# EAGLE design H15R80 (EAGLE 9.6.2)

## Sheet 1 of 2
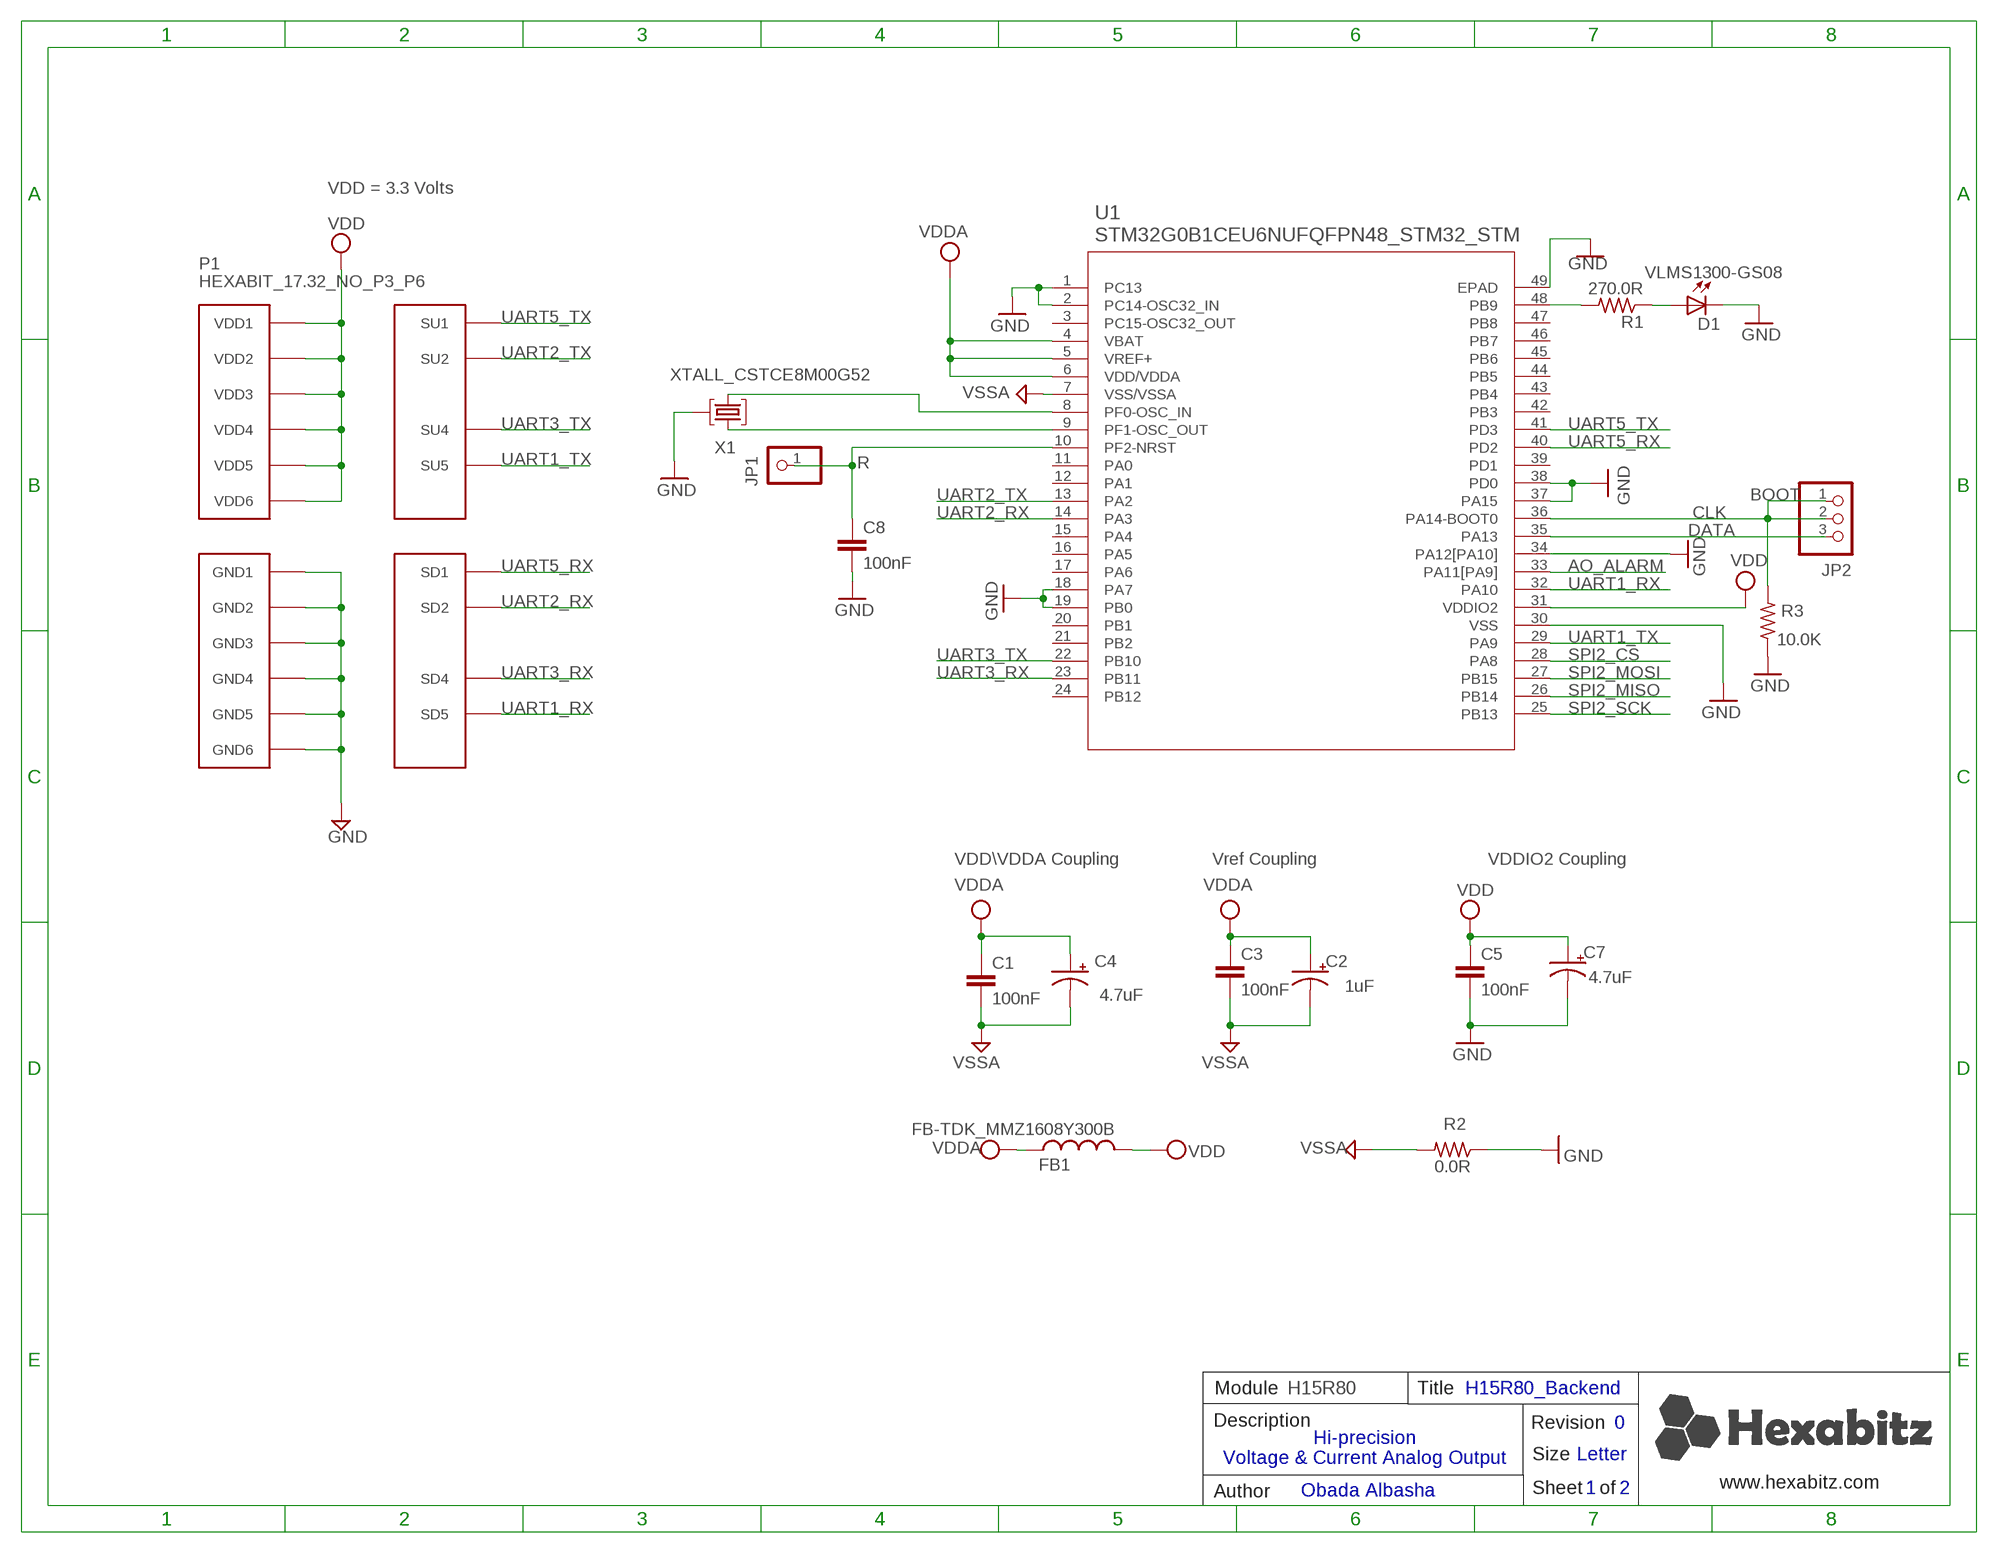
[diagram p0: schematic, sheet 1]

### Parts
C1  100nF  C-0603  [C-0603]
C2  1uF  C-0805-POL  [C-0805-POL]
C3  100nF  C-0603  [C-0603]
C4  4.7uF  C-0805-POL  [C-0805-POL]
C5  100nF  C-0603  [C-0603]
C7  4.7uF  C-0805-POL  [C-0805-POL]
C8  100nF  C-0603  [C-0603]
D1  VLMS1300-GS08  [VLMS1300-GS08]
FB1  FB-TDK_MMZ1608Y300B  [FB-TDK_MMZ1608Y300B]
JP1  R  PINHD-1X1  [1X01]
JP2  PINHD-1X3  [1X03]
P1  HEXABIT_17.32_NO_P3_P6  [HEXABIT_17.32_NO_P3_P6]
R1  270.0R  R-0603  [R-0603]
R2  0.0R  R-0603  [R-0603]
R3  10.0K  R-0603  [R-0603]
U1  STM32G0B1CEU6NUFQFPN48_STM32_STM  [UFQFPN48_STM32_STM]
X1  XTALL_CSTCE8M00G52  [XTALL_CSTCE8M00G52]

### Nets
AO_ALARM: U1.33(PA11[PA9]) ; also sheet 2
CLK: JP2.1 JP2.2 R3.2 U1.36(PA14-BOOT0)
DATA: JP2.3 U1.35(PA13)
GND: C5.2 C7.2(-) C8.2 D1.C P1.PAD_PD7(GND1) P1.PAD_PD8(GND2) P1.PAD_PD9(GND3) P1.PAD_PD10(GND4) P1.PAD_PD11(GND5) P1.PAD_PD12(GND6) R2.1 R3.1 U1.1(PC13) U1.2(PC14-OSC32_IN) U1.18(PA7) U1.19(PB0) U1.30(VSS) U1.34(PA12[PA10]) U1.37(PA15) U1.38(PD0) U1.49(EPAD) X1.P$2
N$3: R1.2 U1.48(PB9)
N$4: D1.A R1.1
N$5: C8.1 JP1.1 U1.10(PF2-NRST)
N$6: U1.9(PF1-OSC_OUT) X1.P$1
N$7: U1.8(PF0-OSC_IN) X1.P$3
SPI2_CS: U1.28(PA8) ; also sheet 2
SPI2_MISO: U1.26(PB14) ; also sheet 2
SPI2_MOSI: U1.27(PB15) ; also sheet 2
SPI2_SCK: U1.25(PB13) ; also sheet 2
UART1_RX: P1.PAD_PD5(SD5) U1.32(PA10)
UART1_TX: P1.PAD_PU5(SU5) U1.29(PA9)
UART2_RX: P1.PAD_PD2(SD2) U1.14(PA3)
UART2_TX: P1.PAD_PU2(SU2) U1.13(PA2)
UART3_RX: P1.PAD_PD4(SD4) U1.23(PB11)
UART3_TX: P1.PAD_PU4(SU4) U1.22(PB10)
UART5_RX: P1.PAD_PD1(SD1) U1.40(PD2)
UART5_TX: P1.PAD_PU1(SU1) U1.41(PD3)
VDD: C5.1 C7.1(+) FB1.2 P1.PAD_PU7(VDD1) P1.PAD_PU8(VDD2) P1.PAD_PU9(VDD3) P1.PAD_PU10(VDD4) P1.PAD_PU11(VDD5) P1.PAD_PU12(VDD6) U1.31(VDDIO2)
VDDA: C1.1 C2.1(+) C3.1 C4.1(+) FB1.1 U1.4(VBAT) U1.5(VREF+) U1.6(VDD/VDDA) ; also sheet 2
VSSA: C1.2 C2.2(-) C3.2 C4.2(-) R2.2 U1.7(VSS/VSSA) ; also sheet 2
Unconnected: U1.3(PC15-OSC32_OUT) U1.11(PA0) U1.12(PA1) U1.15(PA4) U1.16(PA5) U1.17(PA6) U1.20(PB1) U1.21(PB2) U1.24(PB12) U1.39(PD1) U1.42(PB3) U1.43(PB4) U1.44(PB5) U1.45(PB6) U1.46(PB7) U1.47(PB8)

### Notes on the sheet
- VDD = 3.3 Volts
- BOOT
- VDD\VDDA Coupling | Vref Coupling | VDDIO2 Coupling
- Module | H15R80 | Title | H15R80_Backend
- Description | Revision | 0
- Hi-precision
  Voltage & Current Analog Output
- Size | Letter
- www.hexabitz.com
- Author | Obada Albasha | Sheet   of | 1 | 2
- C:/Users/Admin/Desktop/logodraft.bmp

## Sheet 2 of 2
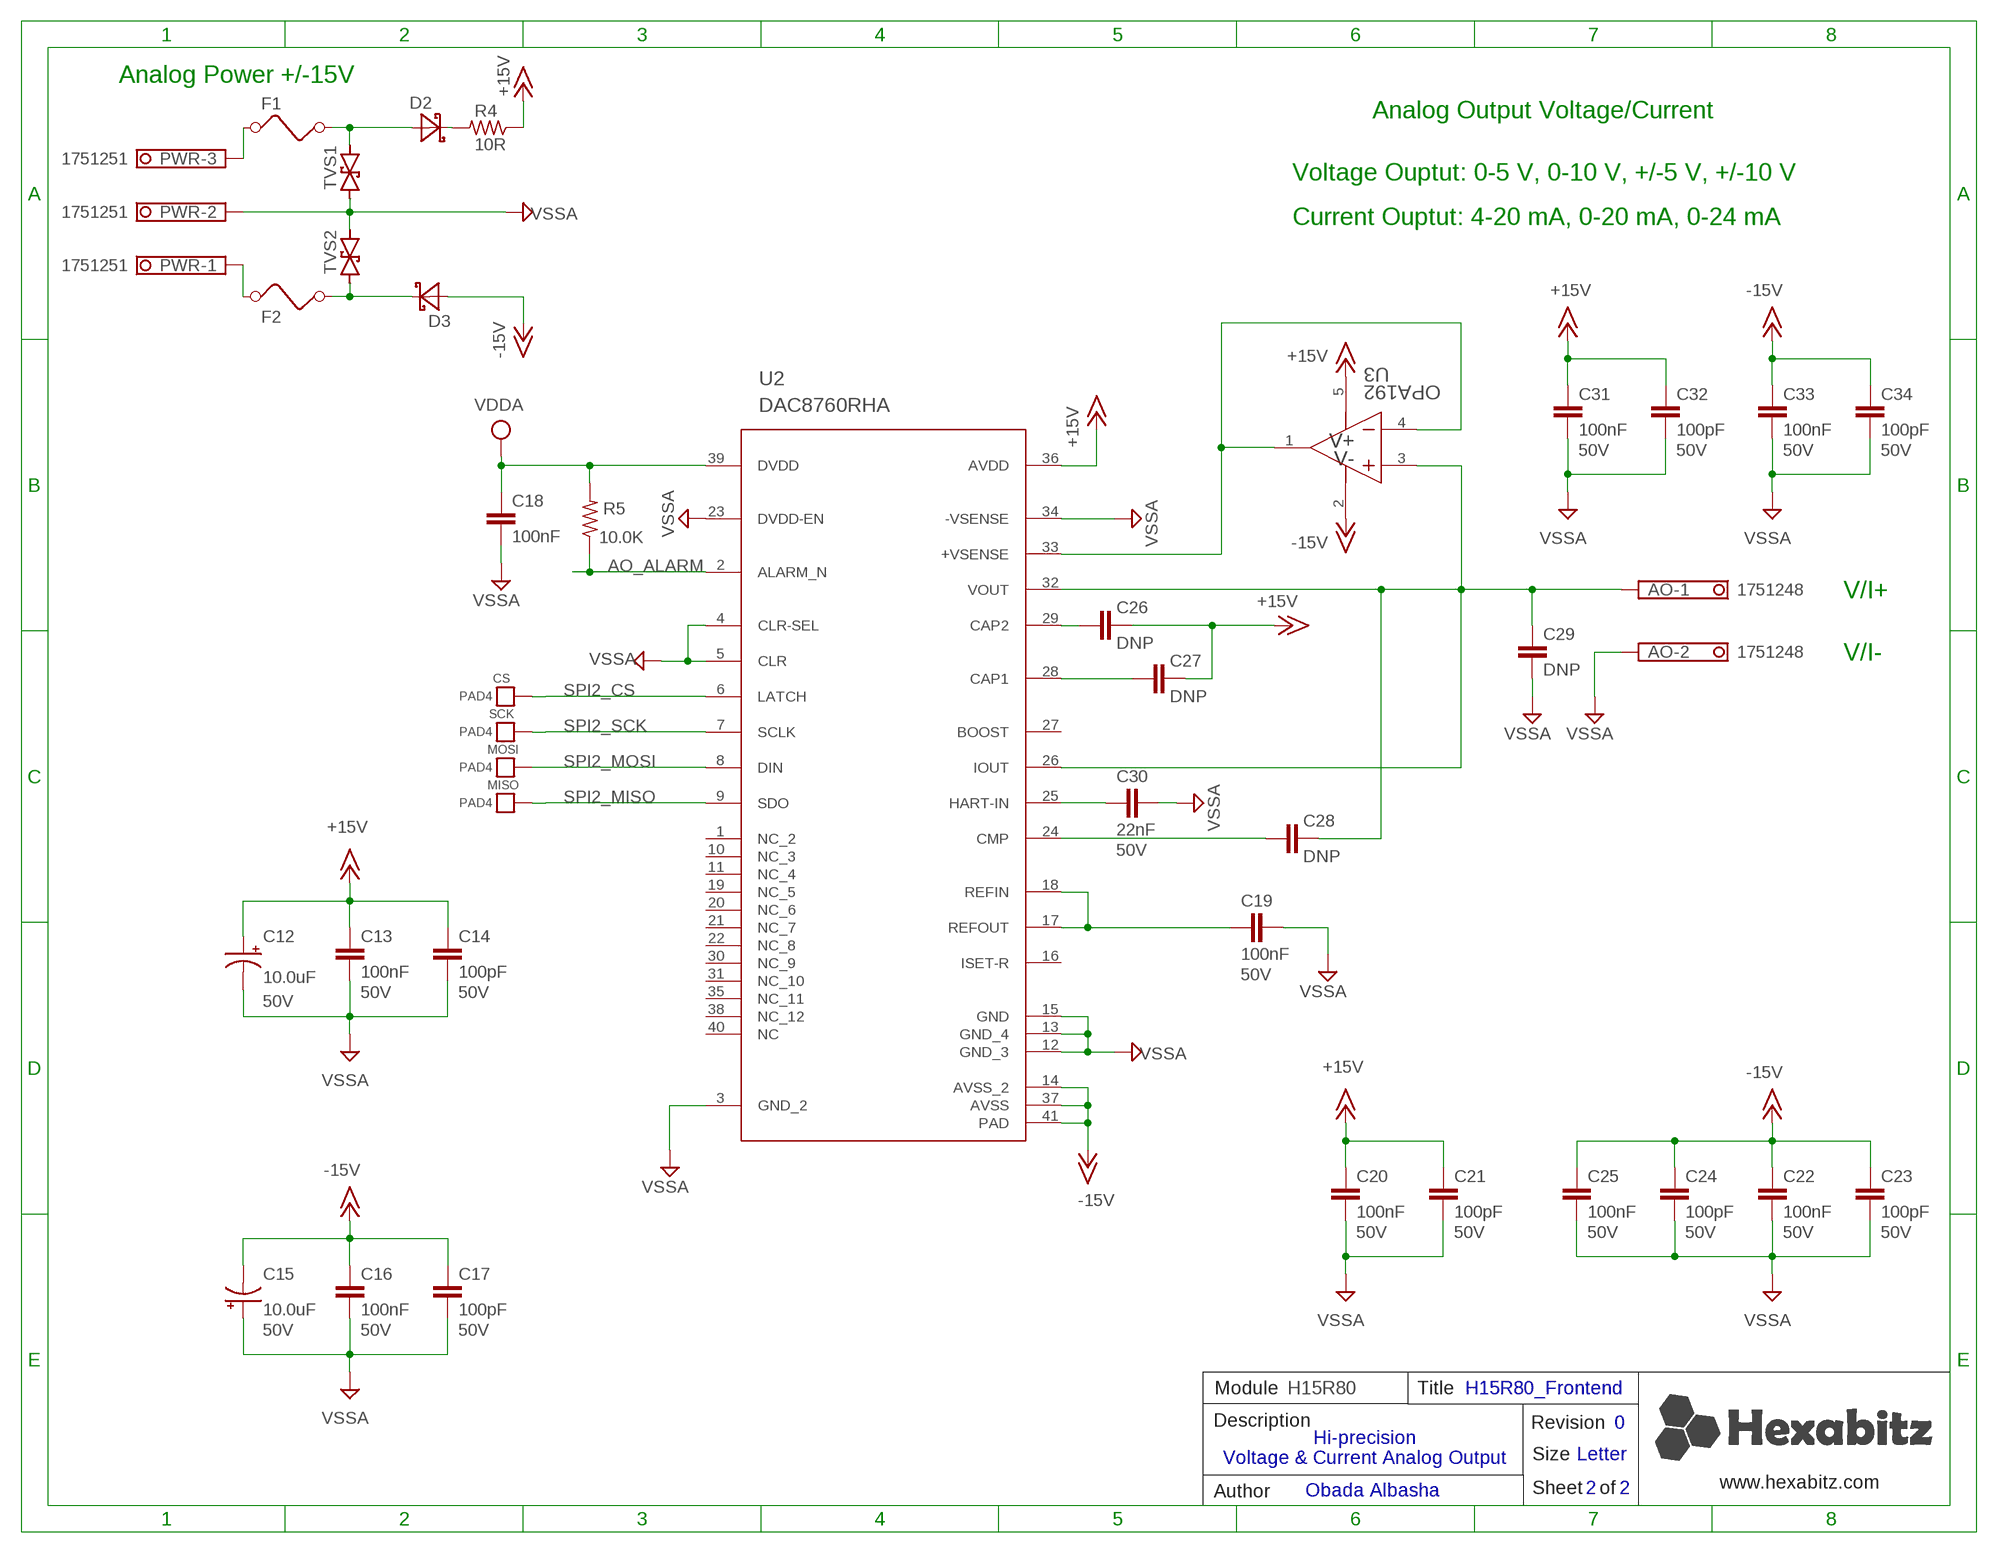
[diagram p1: schematic, sheet 2]

### Parts
AO  1751248  [1751248]
C12  10.0uF  CPOL-USCT7343  [CT7343]
C13  100nF  C-0603  [C-0603]
C14  100pF  C-0603  [C-0603]
C15  10.0uF  CPOL-USCT7343  [CT7343]
C16  100nF  C-0603  [C-0603]
C17  100pF  C-0603  [C-0603]
C18  100nF  C-0603  [C-0603]
C19  100nF  C-0603  [C-0603]
C20  100nF  C-0603  [C-0603]
C21  100pF  C-0603  [C-0603]
C22  100nF  C-0603  [C-0603]
C23  100pF  C-0603  [C-0603]
C24  100pF  C-0603  [C-0603]
C25  100nF  C-0603  [C-0603]
C26  DNP  C-0603  [C-0603]
C27  DNP  C-0603  [C-0603]
C28  DNP  C-0603  [C-0603]
C29  DNP  C-0603  [C-0603]
C30  22nF  C-0603  [C-0603]
C31  100nF  C-0603  [C-0603]
C32  100pF  C-0603  [C-0603]
C33  100nF  C-0603  [C-0603]
C34  100pF  C-0603  [C-0603]
CS  PAD4  [PAD4]
D2  DIOD-SOD-123  [SOD123]
D3  DIOD-SOD-123  [SOD123]
F1  NANOSMDC035F-2120  [R1206]
F2  NANOSMDC035F-2120  [R1206]
MISO  PAD4  [PAD4]
MOSI  PAD4  [PAD4]
PWR  1751251  [1751251]
R4  10R  R-0603  [R-0603]
R5  10.0K  R-0603  [R-0603]
SCK  PAD4  [PAD4]
TVS1  SMBJ30CA  [DO214AA]
TVS2  SMBJ30CA  [DO214AA]
U2  DAC8760RHA  DAC7760IRHAR  [RHA0040A]
U3  OPA192  OPA192IDBVR  [DBV0005A_N]

### Nets
+15V: C12.+ C13.1 C14.1 C20.1 C21.1 C26.2 C27.2 C31.1 C32.1 R4.1 U2.36(AVDD) U3.5(V+)
-15V: C15.- C16.1 C17.1 C22.1 C23.1 C24.1 C25.1 C33.1 C34.1 D3.1(A) U2.14(AVSS_2) U2.37(AVSS) U2.41(PAD) U3.2(V-)
AO_ALARM: R5.1 U2.2(ALARM_N) ; also sheet 1
N$1: AO.1 C28.2 C29.2 U2.26(IOUT) U2.32(VOUT) U3.3(IN+)
N$2: C19.1 U2.17(REFOUT) U2.18(REFIN)
N$8: C26.1 U2.29(CAP2)
N$9: F1.1 PWR.3
N$10: C27.1 U2.28(CAP1)
N$11: C28.1 U2.24(CMP)
N$12: F2.1 PWR.1
N$13: U2.33(+VSENSE) U3.1(OUT) U3.4(IN-)
N$14: C30.1 U2.25(HART-IN)
N$15: D3.2(C) F2.2 TVS2.A
N$16: D2.1(A) F1.2 TVS1.C
N$17: D2.2(C) R4.2
SPI2_CS: CS.P$1 U2.6(LATCH) ; also sheet 1
SPI2_MISO: MISO.P$1 U2.9(SDO) ; also sheet 1
SPI2_MOSI: MOSI.P$1 U2.8(DIN) ; also sheet 1
SPI2_SCK: SCK.P$1 U2.7(SCLK) ; also sheet 1
VDDA: C18.1 R5.2 U2.39(DVDD) ; also sheet 1
VSSA: AO.2 C12.- C13.2 C14.2 C15.+ C16.2 C17.2 C18.2 C19.2 C20.2 C21.2 C22.2 C23.2 C24.2 C25.2 C29.1 C30.2 C31.2 C32.2 C33.2 C34.2 PWR.2 TVS1.A TVS2.C U2.3(GND_2) U2.4(CLR-SEL) U2.5(CLR) U2.12(GND_3) U2.13(GND_4) U2.15(GND) U2.23(DVDD-EN) U2.34(-VSENSE) ; also sheet 1
Unconnected: U2.1(NC_2) U2.10(NC_3) U2.11(NC_4) U2.16(ISET-R) U2.19(NC_5) U2.20(NC_6) U2.21(NC_7) U2.22(NC_8) U2.27(BOOST) U2.30(NC_9) U2.31(NC_10) U2.35(NC_11) U2.38(NC_12) U2.40(NC)

### Notes on the sheet
- Analog Power +/-15V
- Analog Output Voltage/Current
- Voltage Ouptut: 0-5 V, 0-10 V, +/-5 V, +/-10 V
- Current Ouptut: 4-20 mA, 0-20 mA, 0-24 mA
- V/I+
- V/I-
- Module | H15R80 | Title | H15R80_Frontend
- Description | Revision | 0
- Hi-precision
  Voltage & Current Analog Output
- Size | Letter
- www.hexabitz.com
- Author | Obada Albasha | Sheet   of | 2 | 2

## Library data of the parts
AO = con-phoenix-350:1751248: MKDS 1/ 2-3,5 Printklemme Nennstrom: 10 A Bemessungsspannung: 160 V Raster: 3,5 mm Polzahl: 2 Montageart: Löten Anschlussart: Schraubanschluss Anschlussrichtung vom Leiter zur Platine: 0° Source: http://eshop.phoenixcontact.com .. 1751248.pdf; MFN: Phoenix Contact; MPN: 1751248; OCTOPART_URL: https://octopart.com/1751248-phoenix+contact-31334?r=sp&s=dfbEyNHiQNetUL69ahOrPQ; OC_FARNELL: unknown; OC_NEWARK: unknown
C1 = Hexabitz:C-0603: CAP CER 10% X7R 0603; CAPACITANCE: 10nF; MFN: KEMET; MPN: C0603C103K5RACTU; OCTOPART_URL: https://octopart.com/c0603c103k5ractu-kemet-133094?r=sp&s=R_iPBxLnSmGqhkU2rIMFpg; TOLERANCE: 10%; VOLTAGE_RATING: 50V
C2 C7 = Hexabitz:C-0805-POL: Cap Tant Solid SMD 2012; CAPACITANCE: 4.7uF; MFN: Murata; MPN: GRM21BC81E475KA12L; OCTOPART_URL: https://octopart.com/grm21bc81e475ka12l-murata-10331911?r=sp&s=RY3qZSD8T6mG6TC9CHI5qQ; TOLERANCE: 10%; VOLTAGE_RATING: 25V
C3 C8 C18 = Hexabitz:C-0603: CAP CER 10% X7R 0603; CAPACITANCE: 100nF; MFN: KEMET; MPN: C0603C104K8RACTU; OCTOPART_URL: https://octopart.com/c0603c104k8ractu-kemet-145075?r=sp&s=9bS9ASSwSEqMCE9KBEQZ0g; TOLERANCE: 10%; VOLTAGE_RATING: 10V
C4 = Hexabitz:C-0805-POL: Cap Tant Solid SMD 2012; CAPACITANCE: 1.00uF; MFN: Yageo; MPN: CC0805KKX7R7BB105; OCTOPART_URL: https://octopart.com/cc0805kkx7r7bb105-yageo-8376555?r=sp&s=YKl1wwtkROau_X5nniH2ig; TOLERANCE: 10%; VOLTAGE_RATING: 16V
C5 = Hexabitz:C-0603: CAP CER 10% X7R 0603; CAPACITANCE: 100nF; MFN: KEMET; MPN: C0603C104K8RACTU; OCTOPART_URL: https://octopart.com/c0603c104k8ractu-kemet-145075?r=sp&s=9bS9ASSwSEqMCE9KBEQZ0g; TOLERANCE: 10%; VOLTAGE_RATING: 10
C12 C15 = rcl:CPOL-US: POLARIZED CAPACITOR, American symbol; CAPACITANCE: 10.0uF; MFN: KEMET; MPN: T491D106K050AT; OCTOPART_URL: https://octopart.com/t491d106k050at-kemet-968220?r=ap&s=K_G_zr40QourN4WdchG6mQ#; SPICEPREFIX: C; VOLTAGE: 50V
C13 C16 C19 C20 C22 C25 C31 C33 = Hexabitz:C-0603: CAP CER 10% X7R 0603; CAPACITANCE: 100nF; MFN: Samsung; MPN: CL10B104KB8NNNC; OCTOPART_URL: https://octopart.com/cl10b104kb8nnnc-samsung-7928277?r=sp&s=fIKkgin8S22eXTUxF1gXsw; TOLERANCE: 10%; VOLTAGE_RATING: 50V
C14 C17 C21 C23 C24 C32 C34 = Hexabitz:C-0603: CAP CER 10% X7R 0603; CAPACITANCE: 100pF; MFN: Avx; MPN: 06035A101JAT2A; OCTOPART_URL: https://octopart.com/06035a101jat2a-avx-55386344?r=sp&s=WDfgRo-ITV2A4U5JT5ZyKQ; TOLERANCE: 10%; VOLTAGE_RATING: 50V
C26-C29 = Hexabitz:C-0603: CAP CER 10% X7R 0603; CAPACITANCE: DNP; MPN: DNP
C30 = Hexabitz:C-0603: CAP CER 10% X7R 0603; CAPACITANCE: 22nF; MFN: TDK; MPN: C1608X7R1H223K080AA; OCTOPART_URL: https://octopart.com/c1608x7r1h223k080aa-tdk-25947667?r=sp&s=T8cT_uRxS7ewuHBmxCxszg; TOLERANCE: 10%; VOLTAGE_RATING: 50V
CS MISO MOSI SCK = HEXABITZ_CONNECTION_PARTS:PAD4
D1 = Hexabitz:VLMS1300-GS08: Red 0603 130° Clear 54 mcd 2 V Surface Mount ChipLED ; Octopart Url : http://octopart.com/vlms1300-gs08-vishay-21709201; MFN: Vishay; MPN: VLMS1300-GS08; OCTOPART_URL: https://octopart.com/vlms1300-gs08-vishay-21709201?r=sp&s=_gcP4_q8T1SC6PJQPTQ9yA
D2 D3 = HEXABITZ_RCLS:DIOD-SOD-123: 1.0 A Surface Mount Schottky Barrier Rectifier, 40 V, -65 to 125 degC, 2-Pin SOD-123 Package, RoHS, Tape and Reel
F1 F2 = HEXABITZ_RCLS:NANOSMDC035F-2: PTC Resettable Fuse 0.35A(hold) 0.75A(trip) 16VDC 20A 0.6W 0.1s 0.45Ohm SMD Solder Pad 1206; MFN: Littelfuse; MPN: NANOSMDC035F-2; OCTOPART_URL: https://octopart.com/nanosmdc035f-2-littelfuse-74215052?r=sp&s=rfNZOPvgSJy5H1V-bbPI5Q#
FB1 = Hexabitz:FB-TDK_MMZ1608Y300B: Ferrite Beads Multi-Layer 30Ohm 25% 100MHz 1.5A 50mOhm DCR 0603; MFN: TDK; MPN: MMZ1608Y300B; OCTOPART_URL: https://octopart.com/mmz1608y300b-tdk-368280?r=sp&s=cd9_2ZEqQ9q9UNBuQgHAiA
JP1 = HEXABITZ_USER_INTERFACE_PARTS:PINHD-1X1: PIN HEADER; MFN: TE Connectivity; MPN: 87227-1; OCTOPART_URL: https://octopart.com/87227-1-te+connectivity-39512052?r=sp
JP2 = pinhead:PINHD-1X3: PIN HEADER
P1 = hexabitz_connectors:HEXABIT_?_NO_P3_P6: Hexabitz Hexagon Module Connector Hexagon side length = 17.32mm. The following ports are removed: P3 P6
PWR = con-phoenix-350:1751251: MKDS 1/ 3-3,5 Printklemme Nennstrom: 10 A Bemessungsspannung: 160 V Raster: 3,5 mm Polzahl: 3 Montageart: Löten Anschlussart: Schraubanschluss Anschlussrichtung vom Leiter zur Platine: 0° Source: http://eshop.phoenixcontact.com .. 1751251.pdf; MFN: Phoenix Contact; MPN: 1751251; OCTOPART_URL: https://octopart.com/1751251-phoenix+contact-36473?r=sp&s=9M0VWNoHTyq04j3qI6lQOQ; OC_FARNELL: unknown; OC_NEWARK: unknown
R1 = Hexabitz:R-0603: Thick Film Resistors - SMD 0603; MFN: Yageo; MPN: RC0603FR-07270RL; OCTOPART_URL: https://octopart.com/search?q=RC0603FR-07270RL&start=0; RESISTANCE: 270.0 Ohm; TOLERANCE: 1%
R2 = Hexabitz:R-0603: Thick Film Resistors - SMD 0603; MFN: Yageo; MPN: RC0603JR-070RL; OCTOPART_URL: https://octopart.com/rc0603jr-070rl-yageo-1241539?r=sp&s=X2NteqRjRNWrnx42Y0aliA; RESISTANCE: 0.0 Ohm
R3-R5 = Hexabitz:R-0603: Thick Film Resistors - SMD 0603; MFN: Yageo; MPN: RC0603JR-0710KL; OCTOPART_URL: https://octopart.com/search?q=RC0603JR-0710KL&start=0; RESISTANCE: 10.0K Ohm; TOLERANCE: 5%
TVS1 TVS2 = HEXABITZ_RCLS:SMBJ30CA: TVS Diode; MFN: ON Semiconductor; MPN: SMBJ30CA; OCTOPART_URL: https://octopart.com/smbj30ca-on+semiconductor-84331460?r=sp&s=Vl5BdVYHQCeKmKgfbE4rMg
U1 = HEXABITZ_ICs:STM32G0B1CEU6N; COPYRIGHT: Copyright (C) 2022 Ultra Librarian. All rights reserved.; MFN: STMicroelectronics; MPN: STM32G0B1CEU6N; OCTOPART_URL: https://app.ultralibrarian.com/details/c038d58b-752a-11eb-9033-0a34d6323d74/STMicroelectronics/STM32G0B1CEU6N?uid=116364672
U2 = Hexabitz:DAC7760IRHAR: 16-Bit Single-Channel Programmable Current/Voltage Output DAC for 4-20mA current loop applications; MANUFACTURER: Texas Instruments; MFN: Texas Instruments; MPN: DAC8760IRHAR; OCTOPART_URL: https://octopart.com/dac8760irhar-texas+instruments-29661993?r=sp&s=ruhaz_LcRdqODQmkWKrlGA; PARTNUMBER: DAC7760IRHAR; REFDES: RefDes; TYPE: TYPE
U3 = Hexabitz:OPA192IDBVR; ALTERNATE_PARTNUMBER: OPA192IDBVT; APPLICATION_BUILDNUMBER: *; COMPTYPE: IC; MANUFACTURER: Texas Instruments; MFN: Texas Instruments; MOUNTTYPE: SMT; MPN: OPA192IDBVR; OCTOPART_URL: https://octopart.com/opa192idbvr-texas+instruments-33513820?r=sp&s=D6KF1OAATrGkqNyouFfzCw; PACKAGEREFERENCE: DBV0005A; PARTNUMBER: OPA192IDBVR; PIN_COUNT: 5; REFDES: RefDes; ROHS: Y; TYPE: TYPE; VALUE: Value
X1 = Hexabitz:XTALL_CSTCE8M00G52: MURATA CSTCE8M00G52-R0 RESONATOR, SMD, 8MHZ ; Octopart Url : https://octopart.com/cstce8m00g52-r0-murata-7145559; MFN: Murata; MPN: CSTCE8M00G52Z-R0; OCTOPART_URL: https://octopart.com/cstce8m00g52z-r0-murata-17755941?r=sp&s=JDnNJnrHQhyS8Zk4ofFWXw

## Board
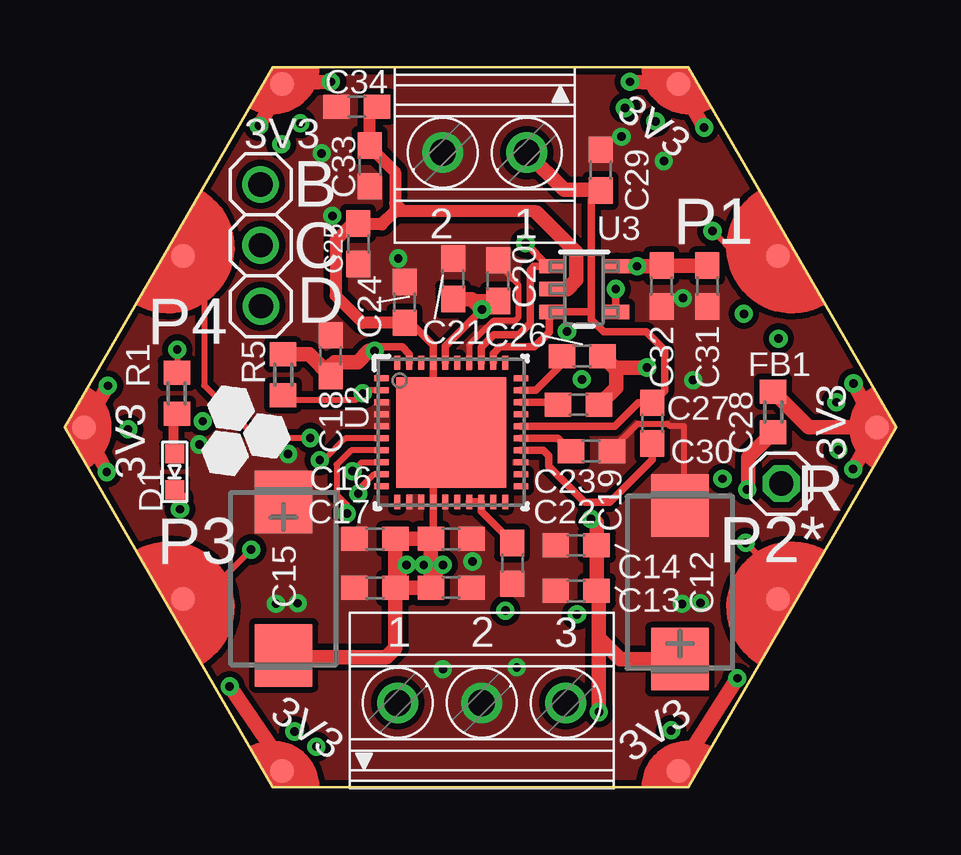
[diagram p2: board, top side]
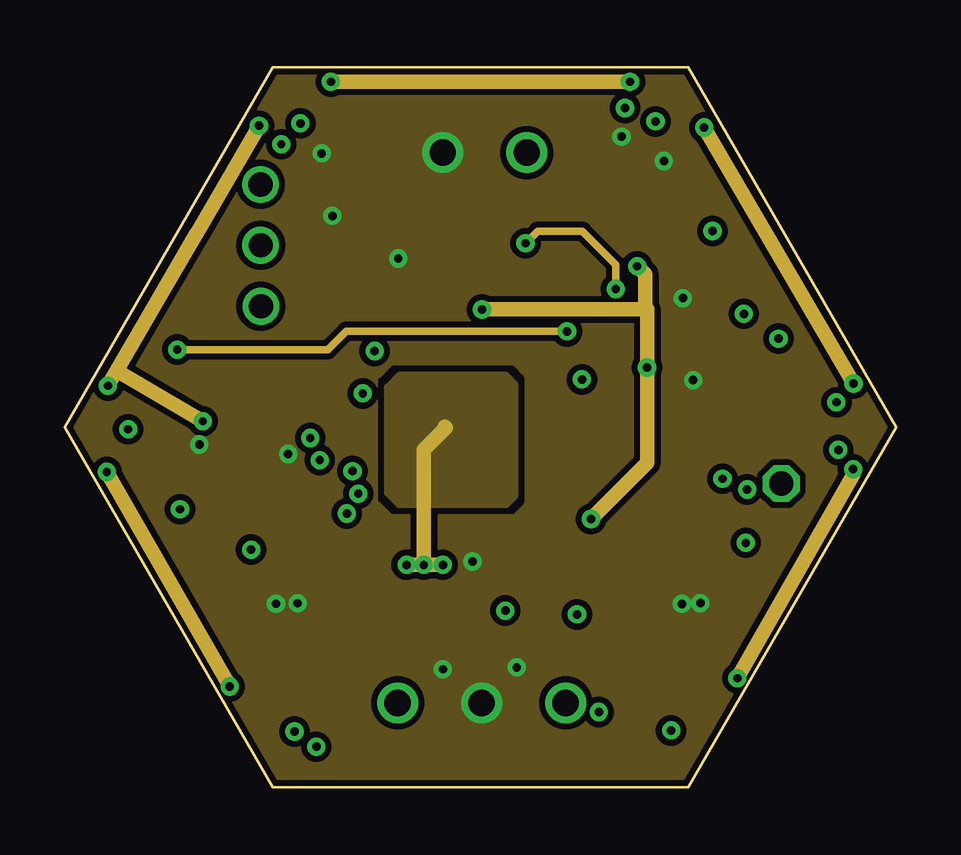
[diagram p3: board, inner layer Route2]
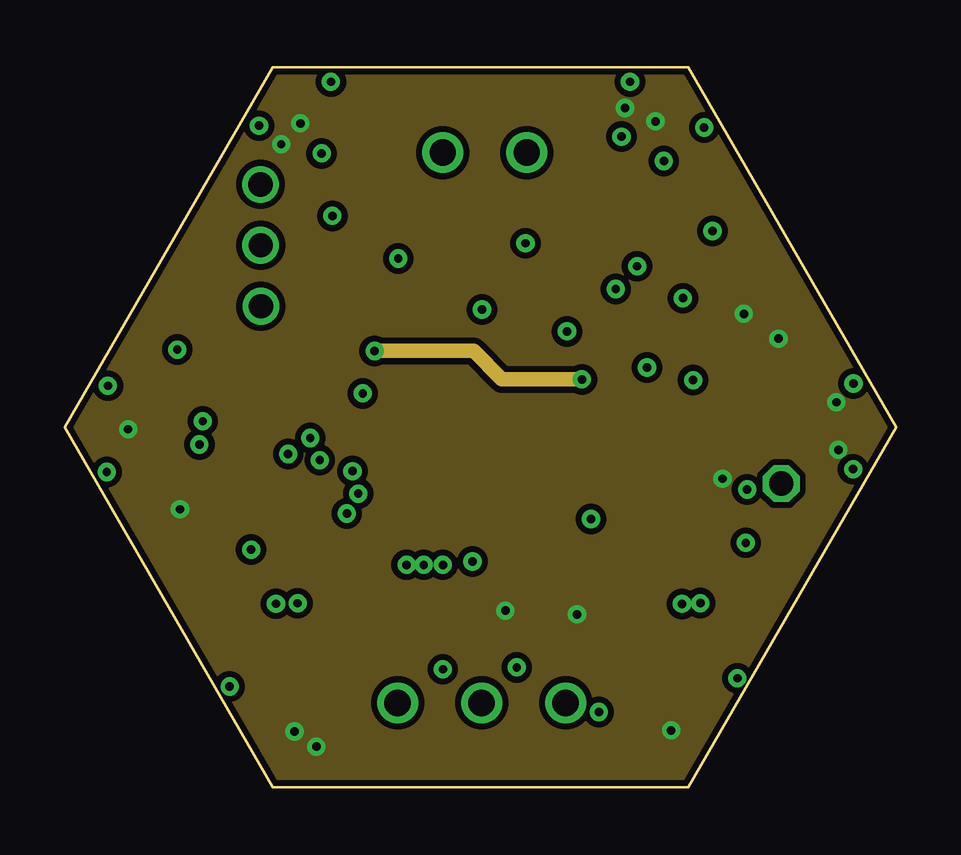
[diagram p4: board, inner layer Route15]
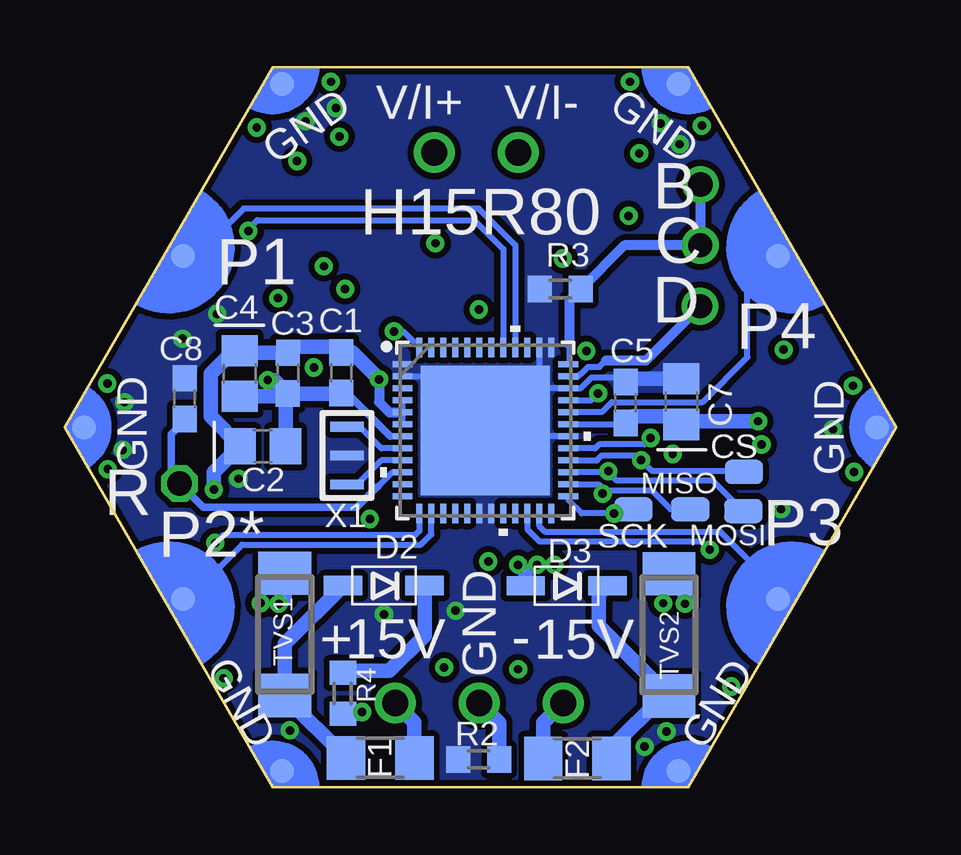
[diagram p5: board, bottom side, seen from below]

Size 34.64 x 30 mm. Coordinates in mm from the lower left corner, seen from the top.
Copper layers ([2:1+2*15+16:15]): Top 0.035mm / dielectric 0.175mm / Route2 0.035mm / dielectric 1.11mm / Route15 0.035mm / dielectric 0.175mm / Bottom 0.035mm
Design rules "2_layer *": minimum track width 7mil, minimum drill 10mil, track to track 6mil, track to pad 6mil, pad to pad 6mil, via to via 6mil, smd to smd 0mil, copper to edge 1mil, drill to drill 8mil, minimum pad ring 10mil, minimum via ring 8mil, stop-mask expansion 2mil, vias tented up to drill 15mil, thermal gap 10mil

### Footprints (pad centres in the part's own frame; a part is rotated, then mirrored left to right if it is on the bottom)
1751248 = drill 1.1 pad 1.7: 1 -1.75,-0.1; 2 1.75,-0.1
C-0603 = smd 1.1 x 1: 1 -0.85,0; 2 0.85,0
C-0805-POL = smd 1.3 x 1.5: 1 -0.95,0; 2 0.95,0
CT7343 = smd 2.6 x 2.4: + -3.2,0; - 3.2,0
PAD4 = smd 1.6 x 1: P$1 0,0
VLMS1300-GS08 = smd 0.8 x 0.8: A 0,0.75; C 0,-0.75
SOD123 = smd 1.6 x 0.8: 1 -1.7,0; 2 1.7,0
R1206 = smd 1.6 x 1.803: 1 -1.422,0; 2 1.422,0
FB-TDK_MMZ1608Y300B = smd 1 x 1.1: 1 -0.85,0; 2 0.85,0
1X01 = drill 1.016 octagon: 1 0,0
1X03 = drill 1.016: 1 -2.54,0; 2 0,0; 3 2.54,0
HEXABIT_17.32_NO_P3_P6 = smd 1 x 1 bottom: PAD_PD1 12.39,7.15; PAD_PD2 12.39,-7.15; PAD_PD4 -12.39,-7.15; PAD_PD5 -12.39,7.15; PAD_PD7 8.26,14.31; PAD_PD8 16.52,0; PAD_PD9 8.26,-14.31; PAD_PD10 -8.26,-14.31; PAD_PD11 -16.52,0; PAD_PD12 -8.26,14.31 | smd 1 x 1: PAD_PU1 12.39,7.15; PAD_PU2 12.39,-7.15; PAD_PU4 -12.39,-7.15; PAD_PU5 -12.39,7.15; PAD_PU7 8.26,14.31; PAD_PU8 16.52,0; PAD_PU9 8.26,-14.31; PAD_PU10 -8.26,-14.31; PAD_PU11 -16.52,0; PAD_PU12 -8.26,14.31
1751251 = drill 1.1 pad 1.7: 1 -3.5,-0.1; 2 0,-0.1; 3 3.5,-0.1
R-0603 = smd 1 x 1.1: 1 -0.85,0; 2 0.85,0
DO214AA = smd 1.8 x 2.2: A 2.55,0; C -2.55,0
UFQFPN48_STM32_STM = smd 0.813 x 0.254: 1 -3.454,2.751; 2 -3.454,2.251; 3 -3.454,1.75; 4 -3.454,1.25; 5 -3.454,0.75; 6 -3.454,0.25; 7 -3.454,-0.25; 8 -3.454,-0.75; 9 -3.454,-1.25; 10 -3.454,-1.75; 11 -3.454,-2.251; 12 -3.454,-2.751; 25 3.454,-2.751; 26 3.454,-2.251; 27 3.454,-1.75; 28 3.454,-1.25; 29 3.454,-0.75; 30 3.454,-0.25; 31 3.454,0.25; 32 3.454,0.75; 33 3.454,1.25; 34 3.454,1.75; 35 3.454,2.251; 36 3.454,2.751 | smd 0.254 x 0.813: 13 -2.751,-3.454; 14 -2.251,-3.454; 15 -1.75,-3.454; 16 -1.25,-3.454; 17 -0.75,-3.454; 18 -0.25,-3.454; 19 0.25,-3.454; 20 0.75,-3.454; 21 1.25,-3.454; 22 1.75,-3.454; 23 2.251,-3.454; 24 2.751,-3.454; 37 2.751,3.454; 38 2.251,3.454; 39 1.75,3.454; 40 1.25,3.454; 41 0.75,3.454; 42 0.25,3.454; 43 -0.25,3.454; 44 -0.75,3.454; 45 -1.25,3.454; 46 -1.75,3.454; 47 -2.251,3.454; 48 -2.751,3.454 | smd 5.385 x 5.385: 49 0,0
RHA0040A = smd 0.6 x 0.25: 1 -2.9,2.25; 2 -2.9,1.75; 3 -2.9,1.25; 4 -2.9,0.75; 5 -2.9,0.25; 6 -2.9,-0.25; 7 -2.9,-0.75; 8 -2.9,-1.25; 9 -2.9,-1.75; 10 -2.9,-2.25; 21 2.9,-2.25; 22 2.9,-1.75; 23 2.9,-1.25; 24 2.9,-0.75; 25 2.9,-0.25; 26 2.9,0.25; 27 2.9,0.75; 28 2.9,1.25; 29 2.9,1.75; 30 2.9,2.25 | smd 0.25 x 0.6: 11 -2.25,-2.9; 12 -1.75,-2.9; 13 -1.25,-2.9; 14 -0.75,-2.9; 15 -0.25,-2.9; 16 0.25,-2.9; 17 0.75,-2.9; 18 1.25,-2.9; 19 1.75,-2.9; 20 2.25,-2.9; 31 2.25,2.9; 32 1.75,2.9; 33 1.25,2.9; 34 0.75,2.9; 35 0.25,2.9; 36 -0.25,2.9; 37 -0.75,2.9; 38 -1.25,2.9; 39 -1.75,2.9; 40 -2.25,2.9 | smd 4.6 x 4.6: 41 0,0
DBV0005A_N = smd 1 x 0.6: 1 -1.375,0.95; 2 -1.375,0; 3 -1.375,-0.95; 4 1.375,-0.95; 5 1.375,0.95
XTALL_CSTCE8M00G52 = smd 1.4 x 0.4: P$1 0,1.2; P$2 0,0; P$3 0,-1.2

### Placement (x,y rotation side)
AO  17.5,26.35 180 top
C1  23.13,17.28 270 bottom
C2  26.39,14.21 0 bottom
C3  25.35,17.26 269.6 bottom
C4  27.35,17.25 270 bottom
C5  11.26,16.04 90 bottom
C7  8.94,16.08 90 bottom
C8  29.64,16.2 90 bottom
C12  25.63,8.55 90 top
C13  21.31,8.19 180 top
C14  21.31,10.1 180 top
C15  9.12,8.7 270 top
C16  12.93,10.35 180 top
C17  12.93,8.32 180 top
C18  11.09,17.99 90 top
C19  18.64,9.34 270 top
C20  18.05,21.12 90 top
C21  16.18,21.19 90 top
C22  16.1,8.32 0 top
C23  16.1,10.35 0 top
C24  14.16,20.21 90 top
C25  12.23,22.65 270 top
C26  21.56,17.97 0 top
C27  21.4,15.94 0 top
C28  24.48,15.18 90 top
C29  22.32,25.72 270 top
C30  21.94,14 0 top
C31  26.77,20.89 270 top
C32  24.86,20.89 270 top
C33  12.7,25.9 270 top
C34  12.17,28.37 180 top
CS  6.34,13.14 0 bottom
D1  4.58,13.15 0 top
D2  21.35,8.41 0 bottom
D3  13.73,8.41 0 bottom
F1  21.5,1.23 180 bottom
F2  13.28,1.21 0 bottom
FB1  29.51,15.64 90 top
JP1  29.85,12.66 0 top
JP2  8.16,22.59 270.1 top
MISO  8.57,11.58 0 bottom
MOSI  6.37,11.52 180 bottom
P1  17.32,15 0 top
PWR  17.37,3.62 0 top
R1  4.67,16.43 90 top
R2  17.39,1.17 0 bottom
R3  14,20.77 0 bottom
R4  23.05,3.92 90 bottom
R5  9.09,17.2 90 top
SCK  10.94,11.58 0 bottom
TVS1  25.47,6.38 90 bottom
TVS2  9.46,6.36 270 bottom
U1  17.12,14.88 0 bottom
U2  16.1,14.8 0 top
U3  21.64,20.77 0 top
X1  22.88,13.83 180 bottom

### Tracks (layer width: path | path; a pad name or v marks a point on that pad's centre or on a via)
+15V  (via drill 0.35)
  Top 0.305: v17.38,19.92 15.85,18.38 U2.36
  Top 0.61: U3.5 v23.85,21.72 24.84,21.72 C32.1 C31.1 | v22.25,3.15 22.25,6.23 | 22.25,6.23 22.25,8.1 C13.1 C14.1 22.16,11.03 21.96,11.22 v21.93,11.18 | 25.14,4.86 C12.+ 23.14,5.35 22.25,6.23 | C27.2 22.97,16.65 22.97,17.42 C26.2 22.89,17.5 v24.26,17.5 | C21.1 16.96,20.34 17.04,20.26 | 17.04,20.26 C20.1 | v17.38,19.92 17.04,20.26
  Route2 0.61: v21.93,11.18 24.26,13.52 v24.26,17.5 24.26,19.92 24.18,19.92 | v23.85,21.72 24.18,21.38 24.18,19.92 | v17.38,19.92 24.18,19.92
  Bottom 0.61: R4.1 22.33,3.07 v22.25,3.15
-15V  (via drill 0.35)
  Top 0.254: U2.41 14.96,14.8 14.45,15.3
  Top 0.305: C24.1 14.42,19.36 15.35,18.43 U2.37 15.35,15.55 U2.41 15.35,14.05 U2.14 15.35,10.45 C23.1
  Top 0.508: 19.66,23.94 19.58,24.01 14.1,24.01 | 12.72,26.75 C33.1 | C33.1 12.7,28.06 C34.1 | C24.1 12.42,19.36 11.28,20.49 11.28,22.8 11.99,23.5 C25.1 12.27,23.46 13.21,23.46 13.76,24.01 | 14.1,24.01 13.76,24.01 | C33.1 12.7,26.69 13.76,25.63 13.76,24.35 | 13.76,24.35 13.76,24.01 | 14.1,24.01 13.76,24.35
  Top 0.61: U3.2 20.93,20.77 21.31,21.15 21.31,22.29 19.66,23.94 | C17.1 13.78,5.8 13.39,5.42 9.2,5.42 C15.- | C17.1 C22.1 | C17.1 C16.1 C23.1 15.25,9.57 v14.96,9.28 15.25,8.98 C22.1 | C17.1 14.48,8.32 | v14.24,9.28 13.78,8.81 C17.1 | v15.75,9.28 15.25,8.78 C22.1
  Route2 0.61: v14.24,9.28 v14.96,9.28 | v14.96,9.28 v15.75,9.28 | 15.84,15.03 15.88,14.99 14.96,14.07 v14.96,9.28
  Bottom 0.61: D3.1 15.43,8.96 v15.75,9.28
  pour Route2: 13.94,17.21 18.39,17.21 18.77,16.83 18.77,12.13 18.39,11.75 13.94,11.75 13.43,12.26 13.43,16.7
AO_ALARM  (via drill 0.35)
  Top 0.254: U2.2 12.54,16.55 v12.41,16.42 v12.41,16.43 12.12,16.14 9.3,16.14 R5.1
  Bottom 0.254: U1.33 12.71,16.13 v12.41,16.42
CLK
  Bottom 0.254: U1.36 13.61,17.68 13.61,18.43
  Bottom 0.406: JP2.1 JP2.2 11.32,22.59 R3.2 13.61,20.31 13.61,18.43
DATA
  Bottom 0.254: U1.35 13.26,17.12 | 13.26,17.12 13.25,17.11 | 13.26,17.12 13.16,17.22 13.14,17.22 12.83,17.53 12.37,17.53 12.1,17.8
  Bottom 0.406: JP2.3 10.42,17.8 12.1,17.8
GND  (via drill 0.35)
  Top 0.61: D1.C 4.58,12.29 4.8,12.07 v4.8,11.59
  Bottom 0.254: C5.2 11.46,17.09 12.69,17.09 13.14,16.64 U1.34 14.65,16.63 15.08,16.19 14.87,16.41 U1.38 | U1.30 16.31,14.63 16.35,14.67 | U1.2 18.43,17.13 17.5,16.19
  Bottom 0.61: C7.2 11.12,17.02 C5.2
  other vias: 24.61,27.75 9.81,27.67 2.64,14.92 25.26,2.38 9.57,2.33 10.48,1.7 18.36,7.37 21.34,7.21 29.74,18.7 28.29,19.73 27.4,12.86 32.23,14.07 23.34,28.31 9.02,26.8 32.15,16.05
  pour Bottom (isolate 0.254, no thermals): 8.66,0 25.98,0 34.64,15 25.98,30 8.66,30 0,15
  pour Route15 (isolate 0.254, no thermals): 8.66,0 25.98,0 34.64,15 25.98,30 8.66,30 0,15
N$1
  Top 0.305: U2.32 17.85,18.07 18.13,18.35 19.57,18.35 20.19,18.97 20.19,19.74 U3.3 21.88,19.82 21.94,19.75 | U2.26 22.91,15.05 23.89,16.03 C28.2 24.99,16.54 24.99,18.23 24.23,18.99 22.45,18.99 21.94,19.5 21.94,19.75 | 21.94,19.75 21.94,24.49 C29.2
  Top 0.61: AO.1 20.81,24.89 22.3,24.89 C29.2
N$2
  Top 0.305: U2.17 U2.18 17.35,11.51 18.64,10.22 C19.1
N$3  (via drill 0.35)
  Top 0.254: v4.69,18.24 4.69,17.29 R1.2
  Route2 0.305: v4.69,18.24 10.96,18.24 11.72,19 v20.92,19
  Bottom 0.254: U1.48 20.54,19 v20.92,19
N$4
  Top 0.406: D1.A 4.51,13.97 4.51,15.42 R1.1
N$5
  Bottom 0.254: 21.59,12.53 21.26,12.86 21.26,12.87 21,13.13 U1.10
  Bottom 0.305: 21.59,12.53 21.63,12.53 22.47,11.68 28.87,11.68 JP1.1 30.19,13 30.19,14.71 29.64,15.27 C8.1
N$6
  Bottom 0.254: X1.P$1 22.44,12.63 21.45,13.63 U1.9 20.58,13.64
N$7
  Bottom 0.254: X1.P$3 22.35,15.03 21.45,14.13 | 21.45,14.13 21.43,14.11 | 20.58,14.11 U1.8 21.45,14.13
N$8
  Top 0.305: U2.29 19.63,16.55 20.71,17.63 C26.1
N$9
  Bottom 0.61: F1.1 20.07,2.72 PWR.3
N$10
  Top 0.305: C27.1 20.45,16.05 U2.28
N$11
  Top 0.305: U2.24 19.93,14.05 20.16,13.81 20.16,13.38 21.67,11.88 22.7,11.88 24.48,13.65 C28.1
N$12
  Bottom 0.61: F2.1 14.71,2.69 PWR.1
N$13  (via drill 0.35)
  Top 0.305: U2.33 17.35,18.33 17.88,18.86 18.91,18.86 19.39,19.34 19.39,21.56 19.55,21.72 U3.1 20.15,21.72 v19.2,22.67 19.37,22.5 | v22.96,20.77 22.96,19.87 U3.4
  Route2 0.305: v19.2,22.67 19.7,23.18 21.56,23.18 22.96,21.78 v22.96,20.77
N$14
  Top 0.305: U2.25 20.55,14.55 C30.1
N$15
  Bottom 0.61: F2.2 11.86,1.65 9.7,3.81 TVS2.A 12.4,6.74 12.4,8.04 D3.2
N$16
  Bottom 0.61: F1.2 25.47,3.78 TVS1.C 25.47,5.99 D2.1
N$17
  Bottom 0.61: D2.2 19.65,6.32 21.11,4.85 22.97,4.85 R4.2
SPI2_CS  (via drill 0.35)
  Top 0.254: v10.62,13.64 10.78,13.64 11.69,14.55 U2.6
  Bottom 0.254: U1.28 12.47,13.63 12.26,13.83 10.82,13.83 v10.62,13.64 10.19,13.2 6.4,13.2 CS.P$1
SPI2_MISO  (via drill 0.35)
  Top 0.254: U2.9 12.87,13.05 12.23,12.4 v12.23,12.24
  Bottom 0.254: U1.26 12.39,12.63 12.23,12.46 v12.23,12.24 12.11,12.36 10.17,12.36 9.39,11.58 MISO.P$1
SPI2_MOSI  (via drill 0.35)
  Top 0.254: v11.99,13.18 12.36,13.55 U2.8
  Bottom 0.254: v11.99,13.18 11.99,13.13 | 11.99,13.13 U1.27 | MOSI.P$1 7.64,12.78 11.65,12.78 11.99,13.13
SPI2_SCK  (via drill 0.35)
  Top 0.254: v11.75,11.41 11.75,11.78 11.33,12.2 11.33,13.45 11.93,14.05 U2.7
  Bottom 0.254: U1.25 13.66,11.98 13.1,11.41 v11.75,11.41 11.58,11.58 SCK.P$1
UART1_RX
  Bottom 0.254: P1.PAD_PD5 5.16,22.15 | 5.16,22.15 5.97,22.15 | 13.65,15.64 U1.32 13.64,15.65 12.25,15.65 11.85,16.05 8.06,16.05 6.19,17.92 6.19,21.02 5.64,21.58 5.16,21.58 | 5.16,20.46 5.16,21.58 | 5.16,21.58 5.16,22.15
UART1_TX  (via drill 0.35)
  Top 0.254: P1.PAD_PU5 5.8,21.28 5.8,16.75 8,14.56 v10.23,14.56
  Bottom 0.254: U1.29 12.55,14.13 12.38,14.3 10.49,14.3 v10.23,14.56
UART2_RX
  Bottom 0.254: U1.14 19.37,10.55 19.8,10.11 27.25,10.11 29.52,7.85 P1.PAD_PD2
UART2_TX  (via drill 0.35)
  Top 0.254: v28.37,10.19 29.54,9.02 29.54,8.01 P1.PAD_PU2
  Bottom 0.254: U1.13 19.87,10.69 20.03,10.53 28.04,10.53 v28.37,10.19
UART3_RX
  Bottom 0.254: P1.PAD_PD4 4.93,8.27 7.33,10.66 14.64,10.66 14.87,10.89 U1.23
UART3_TX  (via drill 0.35)
  Top 0.254: v7.77,9.91 5.49,7.63 5.28,7.85 P1.PAD_PU4
  Bottom 0.254: v7.77,9.91 8.11,10.25 14.87,10.25 15.37,10.75 U1.22
UART5_RX
  Bottom 0.254: P1.PAD_PD1 29.15,22.15 27.19,24.12 17.39,24.12 15.87,22.59 U1.40
UART5_TX  (via drill 0.35)
  Top 0.254: v26.99,23.19 28.03,22.15 P1.PAD_PU1
  Bottom 0.254: v26.99,23.19 26.99,23.26 26.62,23.64 17.58,23.64 16.37,22.43 U1.41
VDD  (via drill 0.35)
  Top 0.61: FB1.2 31,15 P1.PAD_PU8 | P1.PAD_PU9 25.58,0.72 v28.02,4.55 | v32.85,13.26 P1.PAD_PU8 | P1.PAD_PU8 v32.86,16.83 | v26.64,27.5 P1.PAD_PU7 v23.55,29.4 | v11.09,29.4 P1.PAD_PU12 v8.09,27.57 | v1.79,16.74 P1.PAD_PU11 v1.75,13.15 | v6.87,4.21 9.06,1.01 P1.PAD_PU10
  Route2 0.61: v32.85,13.26 32.85,13.03 v28.02,4.55 | v32.86,16.83 v26.64,27.5 | v23.55,29.4 v11.09,29.4 | v8.09,27.57 5.47,23.05 5.46,23.04 | 5.46,23.04 2.16,17.36 v5.75,15.26 | 5.46,23.04 5.43,22.98 v1.79,16.74 | v6.87,4.21 1.77,13.12 v1.75,13.15
  Bottom 0.254: U1.31 11.32,15.13 C5.1
  Bottom 0.61: C5.1 10.98,15.47 9.29,15.47 C7.1 8.81,15.26 v5.75,15.26
VDDA  (via drill 0.35)
  Top 0.305: U2.39 14.35,18.05 14.05,18.35 13.08,18.35 v12.91,18.19
  Top 0.61: v28.43,12.41 28.48,12.47 28.48,13.76 FB1.1 | v12.91,18.19 12.67,18.19 12.21,17.72 11.24,17.72 11.09,17.57 C18.1 10.18,18.05 R5.2
  Route15 0.61: v12.91,18.19 17.03,18.19 18.21,17 v21.55,17
  Bottom 0.254: U1.6 U1.5 U1.4
  Bottom 0.406: v21.55,17 21.55,16.05 21.12,15.62 U1.5
  Bottom 0.61: v21.55,17 22.67,18.13 C1.1 23.36,18.37 25.08,18.37 C3.1 27.27,18.11 C4.1 27.59,18.19 28.56,17.23 28.56,15.46 27.34,14.24 C2.1 28.43,13.12 v28.43,12.41
VSSA  (via drill 0.35)
  Top 0.254: C30.2 22.79,14.08 23.87,15.16 25.1,15.16 25.19,15.07 25.8,15.07 25.8,11.92 C12.- | C20.2 18.05,21.79 18.91,20.93 18.91,19.6 18.75,19.44 17.84,19.44 16.85,18.44 U2.34
  Bottom 0.254: U1.7 21.07,14.63 | 22.86,16.41 23.14,16.41
  Bottom 0.305: 21.07,14.63 22.86,16.41
  Bottom 0.61: R2.2 16.54,2.69 PWR.2 | C4.2 25.47,16.29 | 25.47,16.29 C3.2 | C3.2 23.14,16.41 C1.2 | C2.2 25.44,16.27 25.47,16.29 | C3.2 25.91,16.97 v26.18,16.97 | v8.8,7.65 8.8,8.24 TVS2.C | v25.72,7.65 25.47,7.9 TVS1.A
  other vias: 5.61,14.29 9.31,13.89 26.48,7.68 15.75,4.92 18.83,5 24.96,26.1 10.7,26.42 11.15,23.81 9.7,7.67 16.99,9.42 13.89,22.04 25.75,20.38 23.2,27.12
  pour Top (isolate 0.254, no thermals): 8.66,0 25.98,0 34.64,15 25.98,30 8.66,30 0,15
  pour Route2 (isolate 0.254, rank 2, no thermals): 8.66,0 25.98,0 34.64,15 25.98,30 8.66,30 0,15

### Text on the board
tPlace: 3V3 | 3V3 | P1 | P4 | 3V3 | 3V3 | P3 | P2* | 3V3 | 3V3
bPlace: V/I- | V/I+ | GND | GND | H15R80 | P1 | P4 | GND | GND | P3 | P2* | 15V | - | GND | 15V | + | GND | GND
tNames: B | C | D | R
bNames: B | C | D | R
Document: Total Thickness 1.6 mm / --------------------------------------------------------- / / copper_top_l1.gbr : Top Conductor - Copper: Thickness 0.035 mm / / Dielectric - FR-4: Thickness 0.175 mm / / copper_inner_l2.gbr : GND Plane - Copper: Thickness 0.035 mm / / Dielectric - FR-4: Thickness 1.11 mm / / copper_inner_l3.gbr : VDD Plane - Copper: Thickness 0.035 mm / / Dielectric - FR-4: Thickness 0.175 mm / / copper_bottom_l4.gbr : Bottom Conductor - Copper: Thickness 0.035 mm